# EAGLE design WSP2 (EAGLE 6.4)

## Sheet 1 of 4
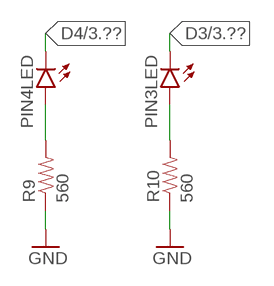
[diagram p0: schematic, sheet 1]

### Parts
PIN3LED  LED0603  [LED-0603]
PIN4LED  LED0603  [LED-0603]
R9  560  RESISTOR0603-RES  [0603-RES]
R10  560  RESISTOR0603-RES  [0603-RES]

### Nets
D3: PIN3LED.C ; also sheet 3
D4: PIN4LED.C ; also sheet 3
GND: R9.1 R10.1 ; also sheet 2,3,4
N$9: PIN4LED.A R9.2
N$10: PIN3LED.A R10.2

## Sheet 2 of 4
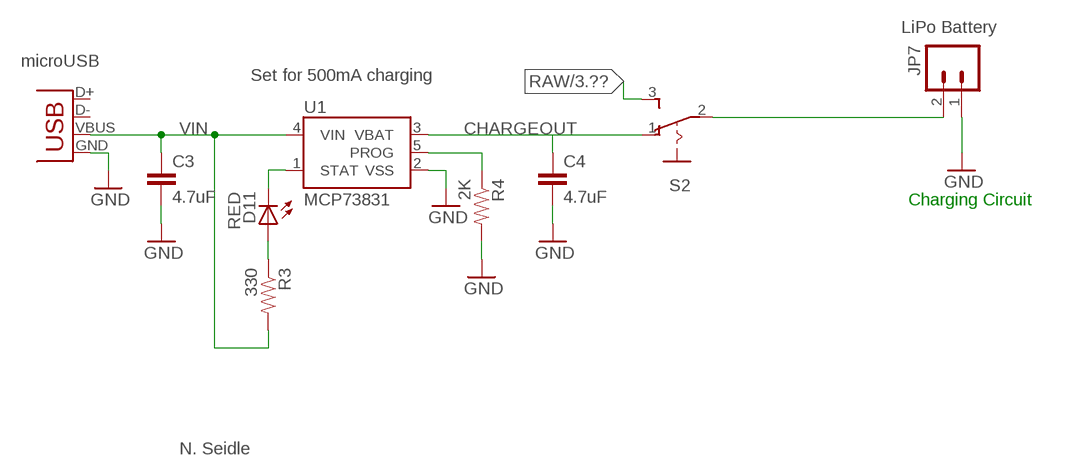
[diagram p1: schematic, sheet 2]

### Parts
C3  4.7uF  CAP0402-CAP  [0402-CAP]
C4  4.7uF  CAP0402-CAP  [0402-CAP]
D11  RED  LED0603  [LED-0603]
JP7  LiPo Battery  M02-JST-2MM-SMT  [JST-2-SMD]
R3  330  RESISTOR0402-RES  [0402-RES]
R4  2K  RESISTOR0402-RES  [0402-RES]
S2  255SB  [255SB]
U1  MCP73831  [SOT23-5]
X1  Micro USB  USB-MICROB  [USB-MICROB]

### Nets
CHARGEOUT: C4.1 S2.1(O) U1.3(VBAT)
GND: C3.2 C4.2 JP7.1 R4.2 U1.2(VSS) X1.GND ; also sheet 1,3,4
N$3: D11.A R3.1
POSBAT [vcc]: JP7.2 S2.2(P)
PROG: R4.1 U1.5(PROG)
RAW [vcc]: S2.3(S) ; also sheet 3
STAT: D11.C U1.1(STAT)
VIN: C3.1 R3.2 U1.4(VIN) X1.VBUS
Unconnected: X1.D+ X1.D-

### Notes on the sheet
- microUSB
- Set for 500mA charging
- Charging Circuit
- N. Seidle

## Sheet 3 of 4
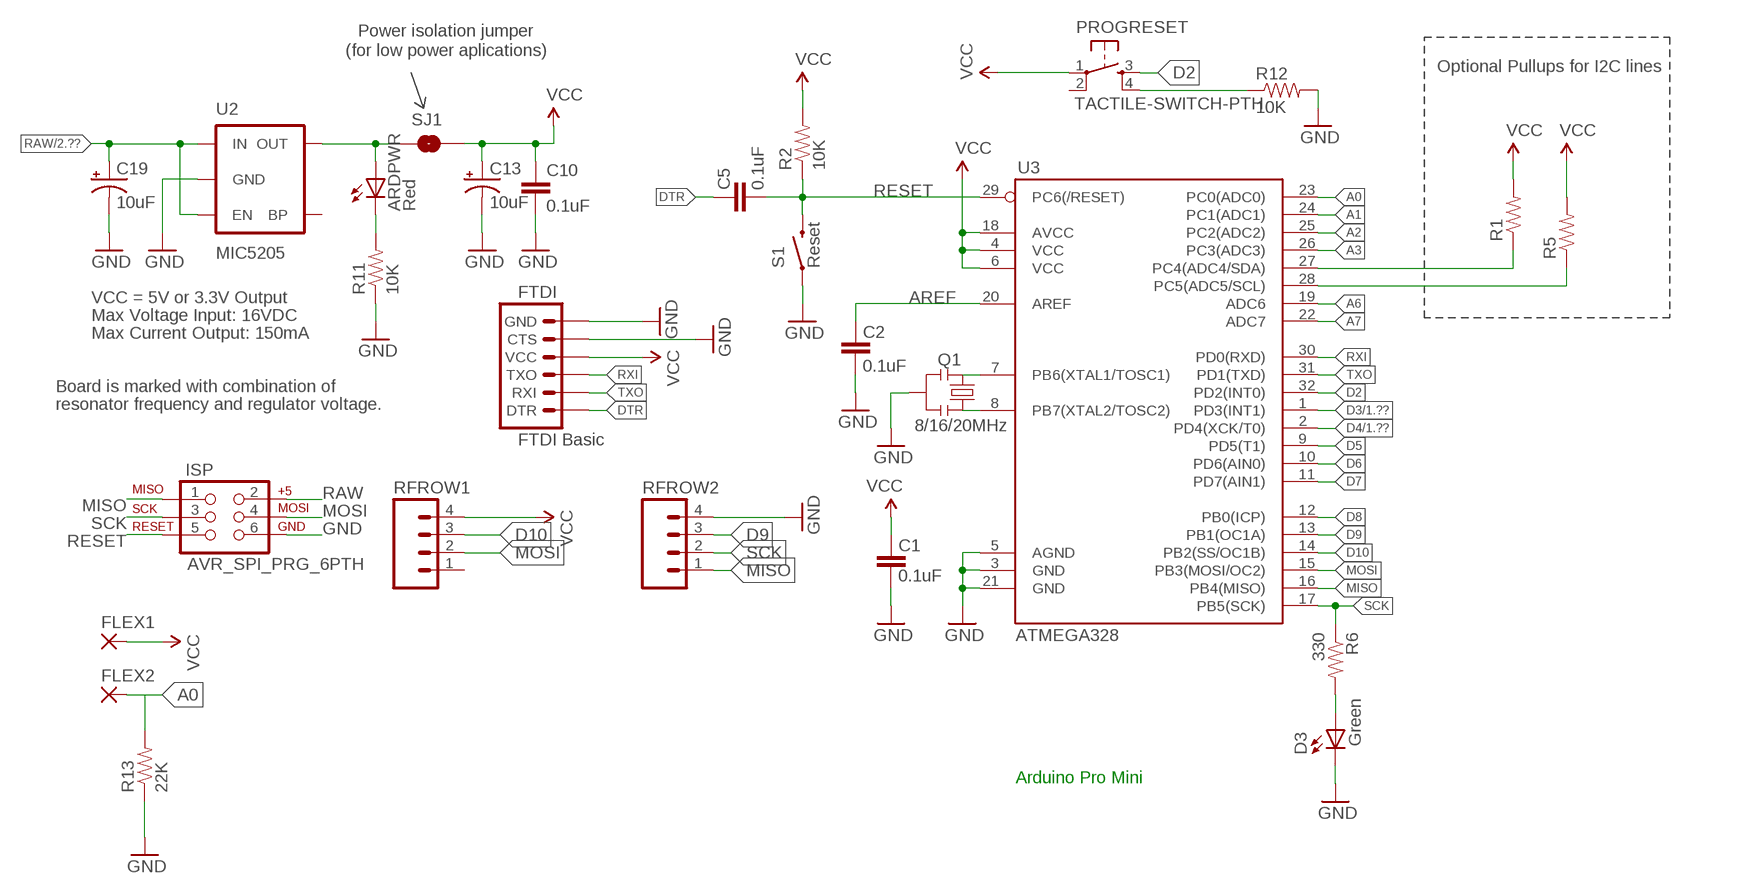
[diagram p2: schematic, sheet 3]

### Parts
ARDPWR  Red  LED  [0603-LED-ALT1]
C1  0.1uF  CAP0603-CAP  [0603-CAP]
C2  0.1uF  CAP0603-CAP  [0603-CAP]
C5  0.1uF  CAP0603-CAP  [0603-CAP]
C10  0.1uF  CAP0603-CAP  [0603-CAP]
C13  10uF  CAP_POL1206  [EIA3216]
C19  10uF  CAP_POL1206  [EIA3216]
D3  Green  LED  [0603-LED-ALT1]
FLEX1  1,6/0,9  [1,6/0,9]
FLEX2  1,6/0,9  [1,6/0,9]
FTDI  FTDI Basic  ARDUINO_SERIAL_PROGRAMPTH  [1X06]
ISP  AVR_SPI_PRG_6PTH  [2X3]
PROGRESET  TACTILE-SWITCH-PTH  [TAC-SWITCH-PTH]
Q1  8/16/20MHz  RESONATOR1:1  [RESONATOR-SMD-1:1]
R1  RESISTOR0603-RES  [0603-RES]
R2  10K  RESISTOR0603-RES  [0603-RES]
R5  RESISTOR0603-RES  [0603-RES]
R6  330  RESISTOR0603-RES  [0603-RES]
R11  10K  RESISTOR0603-RES  [0603-RES]
R12  10K  RESISTOR0603-RES  [0603-RES]
R13  22K  RESISTOR0603-RES  [0603-RES]
RFROW1  M041.27MM  [1X04-1.27MM]
RFROW2  M041.27MM  [1X04-1.27MM]
S1  Reset  SWITCH-MOMENTARY-2SMD-ALT01  [TACTILE-SWITCH-SMD-ALT01]
SJ1  SOLDERJUMPERNC  [SJ_2S]
U2  MIC5205  V_REG_LDOSMD  [SOT23-5]
U3  ATMEGA328  ATMEGA168  [TQFP32-08]

### Nets
3.3V: FLEX1.1(P) FTDI.4(VCC) PROGRESET.1 RFROW1.4 ; supply symbol labelled VCC
A0: FLEX2.1(P) R13.2 U3.23(PC0(ADC0))
A1: U3.24(PC1(ADC1))
A2: U3.25(PC2(ADC2))
A3: U3.26(PC3(ADC3))
A5: R5.1 U3.28(PC5(ADC5/SCL))
A6: U3.19(ADC6)
A7: U3.22(ADC7)
AREF: C2.2 U3.20(AREF)
D2: PROGRESET.3 U3.32(PD2(INT0))
D3: U3.1(PD3(INT1)) ; also sheet 1
D4: U3.2(PD4(XCK/T0)) ; also sheet 1
D5: U3.9(PD5(T1))
D6: U3.10(PD6(AIN0))
D7: U3.11(PD7(AIN1))
D8: U3.12(PB0(ICP))
D9: RFROW2.3 U3.13(PB1(OC1A))
D10: RFROW1.3 U3.14(PB2(SS/OC1B))
DTR: C5.2 FTDI.1(DTR)
GND: C1.1 C2.1 C10.2 C13.C(-) C19.C(-) D3.C FTDI.5(CTS) FTDI.6(GND) ISP.6 Q1.2 R11.1 R12.2 R13.1 RFROW2.4 S1.1 S1.2 U2.2(GND) U3.3(GND) U3.5(AGND) U3.21(GND) ; also sheet 1,2,4
MISO: ISP.1 RFROW2.1 U3.16(PB4(MISO))
MOSI: ISP.4 RFROW1.2 U3.15(PB3(MOSI/OC2))
N$1: Q1.3 U3.8(PB7(XTAL2/TOSC2))
N$2: Q1.1 U3.7(PB6(XTAL1/TOSC1))
N$4: ARDPWR.A SJ1.1 U2.5(OUT)
N$5: ARDPWR.C R11.2
N$7: D3.A R6.2
N$11: PROGRESET.4 R12.1
RAW [vcc]: C19.A(+) ISP.2 U2.1(IN) U2.3(EN) ; also sheet 2
RESET: C5.1 ISP.5 R2.1 S1.3 S1.4 U3.29(PC6(/RESET))
RXI: FTDI.3(TXO) U3.30(PD0(RXD))
SCK: ISP.3 R6.1 RFROW2.2 U3.17(PB5(SCK))
SDA: R1.1 U3.27(PC4(ADC4/SDA)) ; also sheet 4
TXO: FTDI.2(RXI) U3.31(PD1(TXD))
VCC: C1.2 C10.1 C13.A(+) R1.2 R2.2 R5.2 SJ1.2 U3.4(VCC) U3.6(VCC) U3.18(AVCC) ; also sheet 4
Unconnected: PROGRESET.2 RFROW1.1 U2.4(BP)

### Notes on the sheet
- Power isolation jumper
- (for low power aplications)
- Optional Pullups for I2C lines
- VCC = 5V or 3.3V Output
- Max Voltage Input: 16VDC
- Max Current Output: 150mA
- Board is marked with combination of
- resonator frequency and regulator voltage.
- Arduino Pro Mini

## Sheet 4 of 4
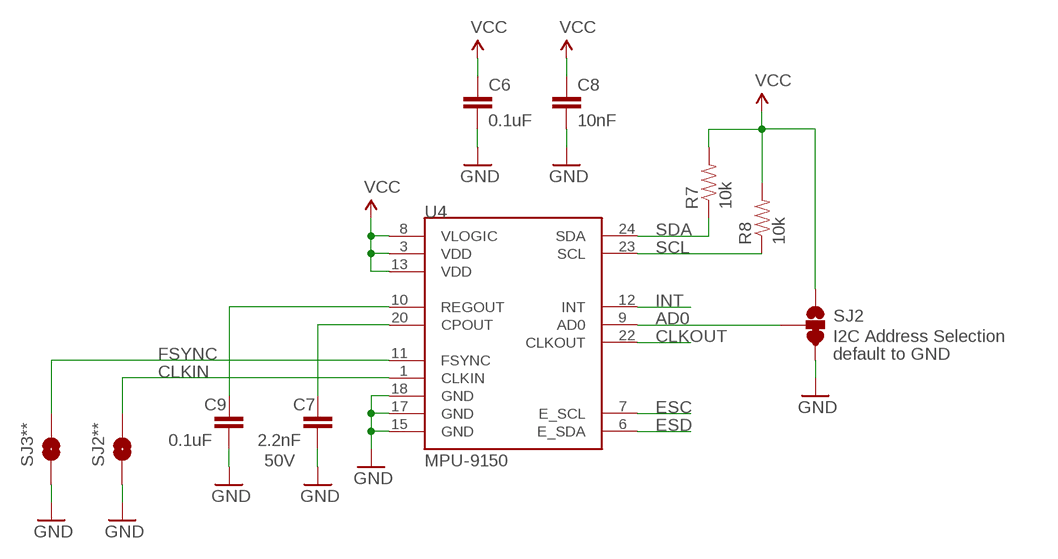
[diagram p3: schematic, sheet 4]

### Parts
C6  0.1uF  CAP0402-CAP  [0402-CAP]
C7  2.2nF  CAP0402-CAP  [0402-CAP]
C8  10nF  CAP0402-CAP  [0402-CAP]
C9  0.1uF  CAP0402-CAP  [0402-CAP]
R7  10k  RESISTOR0402-RES  [0402-RES]
R8  10k  RESISTOR0402-RES  [0402-RES]
SJ2  SOLDERJUMPER_2WAYPASTE2&3  [SJ_3_PASTE2&3]
SJ2**  SOLDERJUMPERTRACE  [SJ_2S-TRACE]
SJ3**  SOLDERJUMPERTRACE  [SJ_2S-TRACE]
U4  MPU-9150  MPU-9150QFN-24-NP  [QFN-24-NP]

### Nets
AD0: SJ2.2 U4.9(AD0)
CLKIN: SJ2**.2 U4.1(CLKIN)
CLKOUT: U4.22(CLKOUT)
ESC: U4.7(E_SCL)
ESD: U4.6(E_SDA)
FSYNC: SJ3**.2 U4.11(FSYNC)
GND: C6.2 C7.2 C8.2 C9.2 SJ2**.1 SJ2.3 SJ3**.1 U4.15(GND) U4.17(GND) U4.18(GND) ; also sheet 1,2,3
INT: U4.12(INT)
N$6: C7.1 U4.20(CPOUT)
N$8: C9.1 U4.10(REGOUT)
SCL: R8.1 U4.23(SCL)
SDA: R7.1 U4.24(SDA) ; also sheet 3
VCC: C6.1 C8.1 R7.2 R8.2 SJ2.1 U4.3(VDD) U4.8(VLOGIC) U4.13(VDD) ; also sheet 3

### Notes on the sheet
- I2C Address Selection
- default to GND
- 50V

## Library data of the parts
ARDPWR D3 = Testing:LED: LEDs Standard schematic elements and footprints for 5mm, 3mm, 1206, and 0603 sized LEDs. 5mm - Spark Fun Electronics SKU : COM-00529 (and others)
C1-C5 C10 = SparkFun:CAP: Capacitor Standard 0603 ceramic capacitor, and 0.1" leaded capacitor.
C6-C9 = SparkFun-Passives:CAP: Capacitor Standard 0603 ceramic capacitor, and 0.1" leaded capacitor.
C13 C19 = SparkFun:CAP_POL: Capacitor Polarized These are standard SMD and PTH capacitors. Normally 10uF, 47uF, and 100uF in electrolytic and tantalum varieties. Always verify the external diameter of the through hole cap, it varies with capacity, voltage, and manufacturer. The EIA devices should be standard.
D11 = SparkFun:LED: LEDs Standard schematic elements and footprints for 5mm, 3mm, 1206, and 0603 sized LEDs. 5mm - Spark Fun Electronics SKU : COM-00529 (and others)
FLEX1 FLEX2 = wirepad:1,6/0,9: THROUGH-HOLE PAD
FTDI = SparkFun:ARDUINO_SERIAL_PROGRAM
ISP = SparkFun-Connectors:AVR_SPI_PRG_6: AVR ISP 6 Pin This is the reduced ISP connector for AVR programming. Common on Arduino. This footprint will take up less PCB space and can be used with a 10-pin to 6-pin adapter such as SKU: BOB-08508 **Special note about "TEST_POINT" package. The stop mask is on the top side, so if you want your programming test points to be on the bottom of your board, make sure to place this package on the bottom side of the board. This also ensure that the orientation to program from the bottom side will be correct.
JP7 = SparkFun:M02: Header 2 Standard 2-pin 0.1" header. Use with straight break away headers (SKU : PRT-00116), right angle break away headers (PRT-00553), swiss pins (PRT-00743), machine pins (PRT-00117), and female headers (PRT-00115). Molex polarized connector foot print use with SKU : PRT-08233 with associated crimp pins and housings.
PIN3LED PIN4LED = SparkFun-LED:LED: LEDs Standard schematic elements and footprints for 5mm, 3mm, 1206, and 0603 sized LEDs. 5mm - Spark Fun Electronics SKU : COM-00529 (and others)
PROGRESET = GeekAmmo:TACTILE-SWITCH: Tactile Switch 4 Pins, SPST NO
Q1 = Testing:RESONATOR: Resonator Small SMD resonator. This is the itty bitty 10/20MHz resonators with built in caps. CSTCE10M0G55 and CSTCE20M0V53. Footprint for SMD has been used in SFE production for years, and does work okay. 1:1 is an attempt to get larger fillets on the sides so it will be easier to inspect these solders in our AOI machine. The pads have been minimized to match the actual metal under the resonator. To see this relation, it includes an image import of the bottom side of the component. Imported to scale on layer 200.
R1-R6 R11 = SparkFun:RESISTOR: Resistor Basic schematic elements and footprints for 0603, 1206, and PTH resistors.
R7 R8 = SparkFun-Passives:RESISTOR: Resistor Basic schematic elements and footprints for 0603, 1206, and PTH resistors.
R9 R10 R12 R13 = SparkFun-Resistors:RESISTOR: Resistor Basic schematic elements and footprints for 0603, 1206, and PTH resistors.
RFROW1 RFROW2 = SparkFun-Connectors:M04: Header 4 Standard 4-pin 0.1" header. Use with straight break away headers (SKU : PRT-00116), right angle break away headers (PRT-00553), swiss pins (PRT-00743), machine pins (PRT-00117), and female headers (PRT-00115). Molex polarized connector foot print use with SKU : PRT-08231 with associated crimp pins and housings. 1MM SMD Version SKU: PRT-10208
S1 = Testing:SWITCH-MOMENTARY-2: Various NO switches- pushbuttons, reed, etc
S2 = switch:255SB: SLIDING SWITCH Distributor Buerklin, 11G810
SJ1 SJ2** SJ3** = SparkFun-Passives:SOLDERJUMPER: Solder Jumper Standard SMD solder jumper. Used to automate production. Two varients : Normally Open and Normally Closed are the same, but have different paste layers. NC will have a large amount of paste and should jumper during reflow.
SJ2 = SparkFun-Passives:SOLDERJUMPER_2WAY: Solder Jumper 2 way solder jumper
U1 = SparkFun:MCP73831: Microchip's MCP73831 Miniature single cell, fully integrated Li-Ion, Li-polymer charge management controller http://ww1.microchip.com/downloads/en/DeviceDoc/21984a.pdf
U2 = SparkFun:V_REG_LDO: Voltage Regulator LDO Standard 150mA LDO voltage regulator in SOT-23 layout. Micrel part MIC5205. BP (by-pass) pin is used to lower output noise with 470pF cap.
U3 = SparkFun:ATMEGA168
U4 = SparkFun-Sensors:MPU-9150: 9DOF (3mag, 3accel, 3rotat). I2C interface.
X1 = SparkFun:USB: USB Connectors USB-B-PTH is fully proven SKU : PRT-00139 USB-miniB is fully proven SKU : PRT-00587 USB-A-PCB is untested. USB-A-H is throughly reviewed, but untested. Spark Fun Electronics SKU : PRT-00437 USB-B-SMT is throughly reviewed, but untested. Needs silkscreen touching up. USB-A-S has not been used/tested USB-MB-H has not been used/tested

## Net classes
1 vcc: width 0.254 mm

## Board
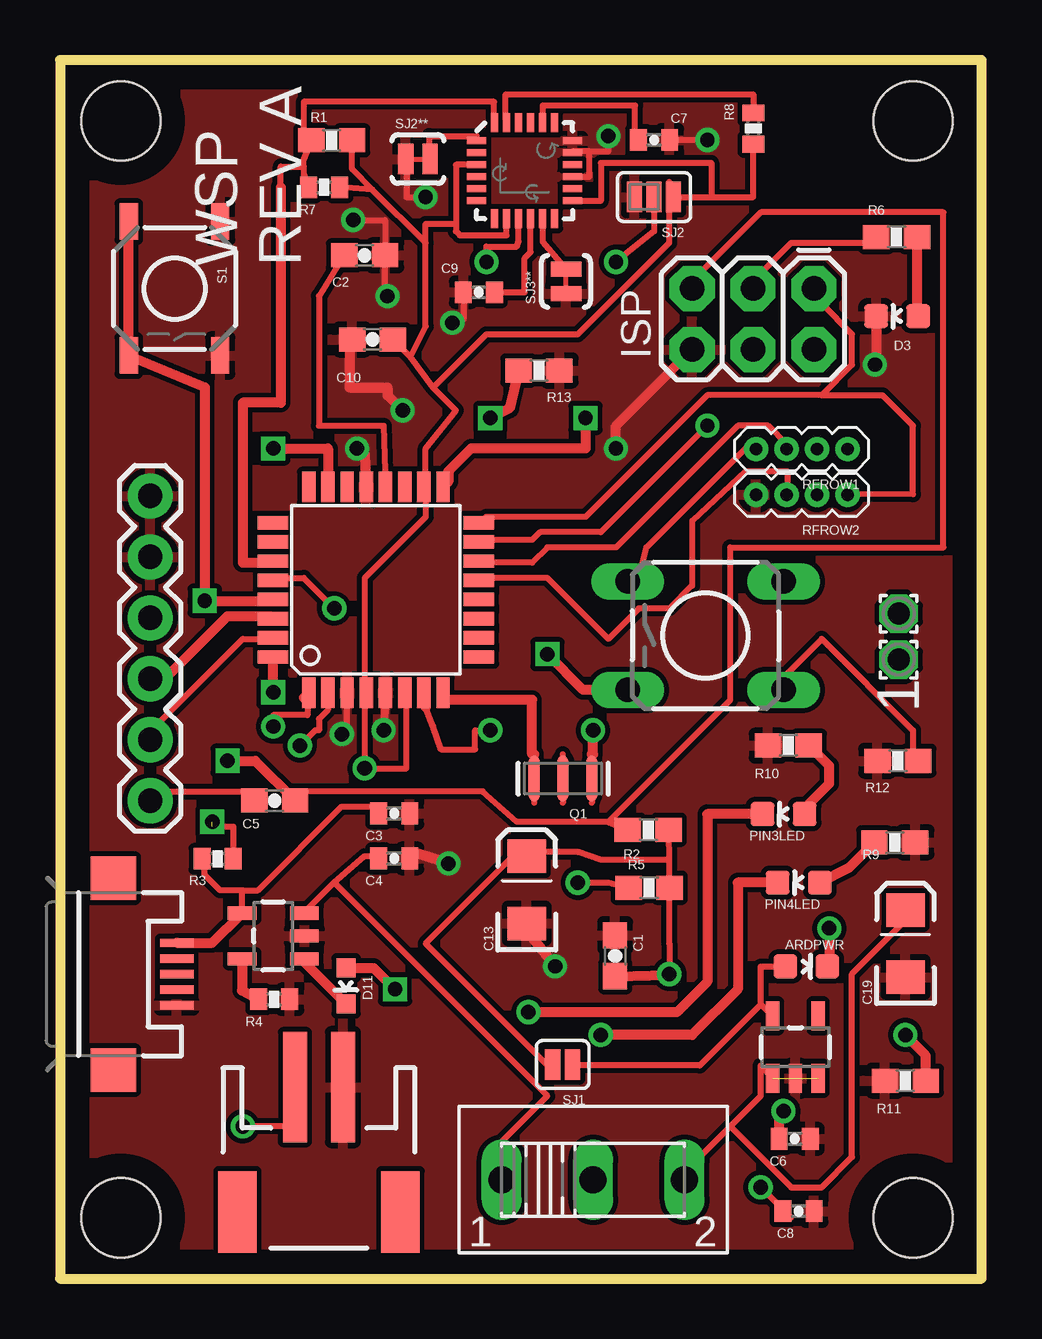
[diagram p4: board, top side]
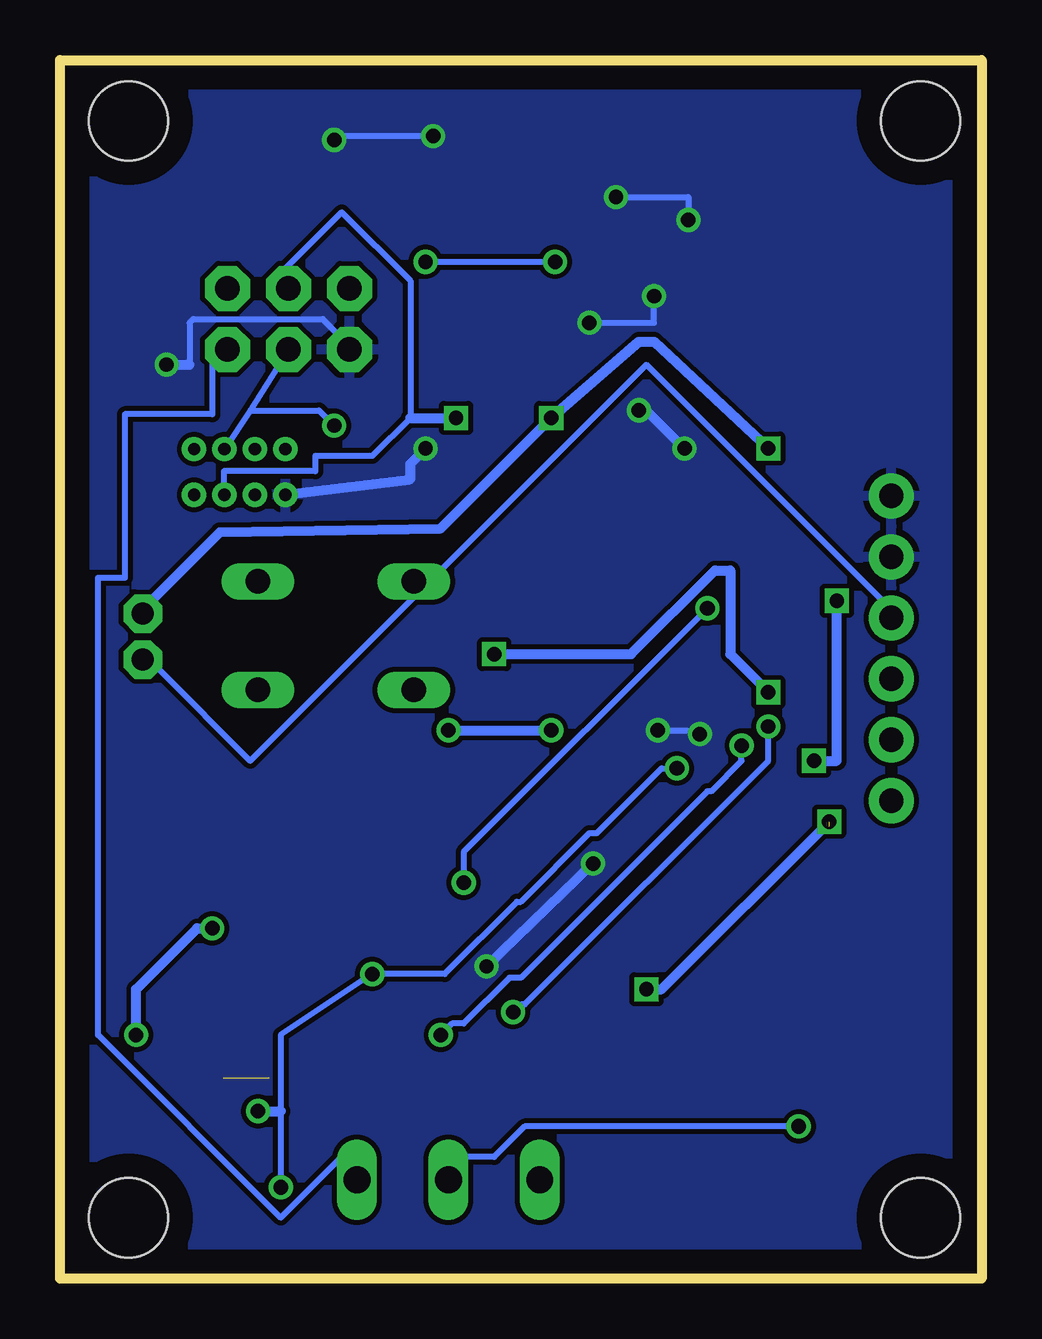
[diagram p5: board, bottom side, seen from below]

Size 38.42 x 50.8 mm. Coordinates in mm from the lower left corner, seen from the top.
Outline: 0,0 38.42,0 38.42,50.8 0,50.8 0,0
Copper layers (1*16): Top 0.035mm / dielectric 1.5mm / Bottom 0.035mm
Design rules "default": minimum track width 10mil, minimum drill 24mil, track to track 8mil, track to pad 8mil, pad to pad 8mil, via to via 8mil, smd to smd 8mil, copper to edge 40mil, drill to drill 8mil, minimum pad ring 10mil, minimum via ring 8mil, stop-mask expansion 4mil, vias tented up to drill 0mil, thermal gap 10mil

### Footprints (pad centres in the part's own frame; a part is rotated, then mirrored left to right if it is on the bottom)
0603-LED-ALT1 = smd 1 x 1: A 0,-0.877; C 0,0.877
0603-CAP = smd 1.1 x 1: 1 -0.85,0; 2 0.85,0
0402-CAP = smd 0.7 x 0.9: 1 -0.65,0; 2 0.65,0
EIA3216 = smd 1.4 x 1.6: A 1.4,0; C -1.4,0
LED-0603 = smd 0.8 x 0.8: A 0,-0.75; C 0,0.75
1,6/0,9 = drill 0.914 pad 1.6 octagon: 1 0,0
1X06 = drill 1.016 pad 1.88: 1 0,0; 2 2.54,0; 3 5.08,0; 4 7.62,0; 5 10.16,0; 6 12.7,0
2X3 = drill 1.016 pad 1.88 octagon: 1 0,0; 2 0,2.54; 3 2.54,0; 4 2.54,2.54; 5 5.08,0; 6 5.08,2.54
STAND-OFF = hole 3.302: 0,0
JST-2-SMD = smd 1 x 4.6: 1 -1,-3.7; 2 1,-3.7 | smd 1.6 x 3.4: NC1 -3.4,1.5; NC2 3.4,1.5
LED-0603' = smd 1 x 1: A 0,-0.877; C 0,0.877
TAC-SWITCH-PTH = drill 1.016 pad 1.524 long: 1 -3.251,2.261; 2 3.251,2.261; 3 -3.251,-2.261; 4 3.251,-2.261
RESONATOR-SMD-1:1 = smd 0.45 x 1.905: 1 -1.2,0; 2 0,0; 3 1.2,0
0603-RES = smd 1.1 x 1: 1 -0.85,0; 2 0.85,0
0402-RES = smd 0.7 x 0.9: 1 -0.65,0; 2 0.65,0
1X04-1.27MM = drill 0.508 pad 1: 1 0,0; 2 1.27,0; 3 2.54,0; 4 3.81,0
TACTILE-SWITCH-SMD-ALT01 = smd 1.524 x 0.762: 1 -2.794,1.905; 2 2.794,1.905; 3 -2.794,-1.905; 4 2.794,-1.905
255SB = drill 1.118 long: 1 -3.81,0; 2 0,0; 3 3.81,0
SJ_2S = smd 0.635 x 1.27: 1 -0.412,0; 2 0.412,0
SJ_3_PASTE2&3 = smd 0.635 x 1.27: 1 -0.813,0; 2 0,0; 3 0.813,0
SJ_2S-TRACE = smd 0.635 x 1.27: 1 -0.508,0; 2 0.508,0
SOT23-5 = smd 0.55 x 1.2: 1 -0.95,-1.3; 2 0,-1.3; 3 0.95,-1.3; 4 0.95,1.3; 5 -0.95,1.3
TQFP32-08 = smd 1.27 x 0.559: 1 -4.293,2.8; 2 -4.293,2; 3 -4.293,1.2; 4 -4.293,0.4; 5 -4.293,-0.4; 6 -4.293,-1.2; 7 -4.293,-2; 8 -4.293,-2.8; 17 4.293,-2.8; 18 4.293,-2; 19 4.293,-1.2; 20 4.293,-0.4; 21 4.293,0.4; 22 4.293,1.2; 23 4.293,2; 24 4.293,2.8 | smd 0.559 x 1.27: 9 -2.8,-4.293; 10 -2,-4.293; 11 -1.2,-4.293; 12 -0.4,-4.293; 13 0.4,-4.293; 14 1.2,-4.293; 15 2,-4.293; 16 2.8,-4.293; 25 2.8,4.293; 26 2,4.293; 27 1.2,4.293; 28 0.4,4.293; 29 -0.4,4.293; 30 -1.2,4.293; 31 -2,4.293; 32 -2.8,4.293
QFN-24-NP = smd 0.8 x 0.3: 1 -2,1.25; 2 -2,0.75; 3 -2,0.25; 4 -2,-0.25; 5 -2,-0.75; 6 -2,-1.25; 13 2,-1.25; 14 2,-0.75; 15 2,-0.25; 16 2,0.25; 17 2,0.75; 18 2,1.25 | smd 0.3 x 0.8: 7 -1.25,-2; 8 -0.75,-2; 9 -0.25,-2; 10 0.25,-2; 11 0.75,-2; 12 1.25,-2; 19 1.25,2; 20 0.75,2; 21 0.25,2; 22 -0.25,2; 23 -0.75,2; 24 -1.25,2
USB-MICROB = smd 0.35 x 1.4: D+ 0,2.65; D- -0.65,2.65; GND 1.3,2.65; ID 0.65,2.65; VBUS -1.3,2.65 | smd 1.8 x 1.9: MT1 -4,0; MT2 4,0

### Placement (x,y rotation side)
ARDPWR  31.11,13.02 270 top
C1  23.14,13.46 270 top
C2  12.7,42.66 180 top
C3  13.93,19.39 0 top
C4  13.93,17.52 0 top
C5  8.95,19.93 180 top
C6  30.63,5.83 0 top
C7  24.77,47.47 0 top
C8  30.78,2.82 0 top
C9  17.46,41.12 180 top
C10  13.03,39.15 180 top
C13  19.46,16.21 90 top
C19  35.24,13.97 90 top
D3  34.9,40.12 90 top
D11  11.93,12.2 180 top
FLEX1  34.96,25.81 0 top
FLEX2  34.96,27.72 0 top
FTDI  3.76,19.93 90 top
ISP  31.43,41.27 180 top
JP1  STAND-OFF  [STAND-OFF]  2.54,2.54 0 top
JP2  STAND-OFF  [STAND-OFF]  35.56,48.26 0 top
JP7  10.79,4.29 180 top
JP14  STAND-OFF  [STAND-OFF]  2.54,48.26 0 top
JP15  STAND-OFF  [STAND-OFF]  35.56,2.54 0 top
PIN3LED  [LED-0603']  30.16,19.37 90 top
PIN4LED  [LED-0603']  30.8,16.51 90 top
PROGRESET  26.91,26.81 0 top
Q1  20.97,20.85 180 top
R1  11.33,47.45 0 top
R2  24.52,18.71 0 top
R3  6.57,17.5 180 top
R4  8.93,11.65 0 top
R5  24.56,16.29 0 top
R6  34.87,43.42 0 top
R7  11.01,45.49 0 top
R8  28.91,47.94 270 top
R9  34.8,18.19 180 top
R10  30.37,22.23 0 top
R11  35.24,8.26 0 top
R12  34.92,21.59 180 top
R13  19.97,37.86 180 top
RFROW1  32.83,34.58 180 top
RFROW2  32.83,32.68 180 top
S1  4.78,41.27 270 top
S2  22.23,4.13 0 top
SJ1  20.95,8.93 180 top
SJ2  24.77,45.09 180 top
SJ2**  14.92,46.67 0 top
SJ3**  21.09,41.57 90 top
U1  8.89,14.29 90 top
U2  30.66,9.65 0 top
U3  13.17,28.71 90 top
U4  19.37,46.18 0 top
X1  2.22,12.7 270 top

### Tracks (layer width: path | path; a pad name or v marks a point on that pad's centre or on a via)
3.3V
  Top 0.254: RFROW1.4 28.57,34.61 24.45,30.48 24.13,29.21 PROGRESET.1
  Bottom 0.254: 22.86,29.21 30.48,21.59 34.29,25.4 FLEX1.1 | 22.86,29.21 13.97,38.1 3.81,27.94 FTDI.4 | 22.86,29.21 PROGRESET.1
A0  (via drill 0.6)
  Top 0.406: R13.2 18.73,36.27 v17.94,35.88 | v8.89,34.61 11.17,34.61 U3.23
  Bottom 0.406: v8.89,34.61 13.65,39.05 14.29,39.05 v17.94,35.88 22.54,31.27 31.75,31.11 34.96,27.9 FLEX2.1
A5  (via drill 0.61)
  Top 0.254: v21.59,16.51 22.86,16.51 R5.1 | v11.43,27.94 10.16,29.21 8.89,29.21 U3.28
  Bottom 0.254: v21.59,16.51 21.59,17.78 v11.43,27.94
AD0  (via drill 0.6)
  Top 0.254: SJ2.2 24.77,43.66 v23.18,42.39 | v17.78,42.39 17.78,43.02 19.05,43.02 19.12,43.25 U4.9
  Bottom 0.254: v23.18,42.39 v17.78,42.39
AREF
  Top 0.254: C2.2 10.79,40.96 10.79,35.56 13.49,35.56 U3.20
CHARGEOUT
  Top 0.254: 11.43,16.51 10.16,15.24 U1.3 | 11.43,16.51 12.7,17.62 13.18,17.62 C4.1 | 11.43,16.51 20.32,7.62 17.78,5.08 S2.1
CLKIN
  Top 0.254: SJ2**.2 15.4,46.67 15.4,47.62 17.37,47.62 U4.1
D2  (via drill 0.6)
  Top 0.406: PROGRESET.3 21.81,24.55 v20.32,26.04 | v8.89,24.45 U3.32
  Bottom 0.406: v20.32,26.04 14.61,26.04 11.11,29.53 10.48,29.53 10.48,26.04 v8.89,24.45
D3  (via drill 0.6)
  Top 0.254: U3.1 10.32,24.42 10.32,23.5 8.89,23.5 v8.89,23.02
  Top 0.406: PIN3LED.C 26.99,19.37 26.99,12.38 25.72,11.11 v19.53,11.11 | 10.16,24.21 U3.1
  Bottom 0.254: v8.89,23.02 8.89,21.59 19.05,11.43 19.21,11.43 v19.53,11.11
  Bottom 0.406: v19.53,11.11 19.37,11.11
D4  (via drill 0.6)
  Top 0.254: U3.2 11.17,23.71 10.79,23.34 10.79,22.86 10.64,22.86 v10,22.23
  Top 0.406: PIN4LED.C 28.26,16.51 28.26,12.06 26.35,10.16 v22.54,10.16 | 11.11,24.36 U3.2
  Bottom 0.254: v10,22.23 10,21.59 11.27,20.32 11.43,20.32 19.21,12.54 19.68,12.54 21.59,10.64 22.07,10.64 v22.54,10.16
  Bottom 0.406: v22.54,10.16 22.23,10.16
D9
  Top 0.254: U3.13 17.78,29.21 20.32,29.21 22.86,26.67 24.13,27.94 25.4,27.94 26.35,28.89 26.35,31.59 28.57,33.66 30.32,33.66 30.32,32.87 RFROW2.3
D10
  Top 0.254: RFROW1.3 30.29,34.8 29.53,35.56 28.26,35.56 23.18,30.48 20.32,30.48 19.68,29.84 17.53,29.84 U3.14
DTR
  Top 0.254: C5.2 7.62,20.32 3.81,20.32 FTDI.1
FSYNC
  Top 0.254: 20.64,42.06 SJ3**.2 20.12,43.22 U4.11
GND  (via drill 0.6)
  Top 0.254: SJ2**.1 14.45,46.67 14.45,45.09 v15.24,45.09 | v12.22,44.13 13.55,44.13 C2.1 13.55,40.96 v13.65,40.96 | C9.2 16.83,41.12 16.83,40.01 16.35,40.01 v16.35,39.85 | 22.07,46.99 21.37,46.99 U4.17 | v11.75,22.7 11.97,22.54 U3.3 | U4.15 22.07,45.93 22.07,46.99 | 22.07,46.99 22.86,46.99 v22.86,47.62 | v26.99,47.47 C7.2 | U3.5 13.49,24.42 v13.49,22.86 13.65,24.42 U3.5
  Top 0.406: C10.2 12.06,39.15 12.06,37.15 13.65,37.15 13.65,36.83 v14.29,36.2 | v12.38,34.61 12.7,34.35 U3.21 | D3.C 34.02,38.15 v33.97,38.1 | v23.18,34.61 23.18,35.56 ISP.6 | C13.C 19.46,14.52 v20.64,13.02 | v16.19,17.3 14.68,17.78 C4.2
  Bottom 0.254: v15.24,45.09 12.22,45.09 v12.22,44.13 | v16.35,39.85 13.65,39.85 v13.65,40.96 | v13.49,22.86 11.75,22.86 v11.75,22.7 | 33.02,38.1 33.02,39.85 32.86,40.01 27.46,40.01 26.35,38.89 ISP.6 | v22.86,47.62 26.99,47.62 v26.99,47.47
  Bottom 0.406: v14.29,36.2 13.97,36.2 v12.38,34.61 | v33.97,38.1 33.02,38.1 | RFROW2.4 23.84,33.31 23.81,33.34 23.81,33.97 v23.18,34.61 | v20.64,13.02 v16.19,17.3
  pour Top: -1.91,52.7 40.01,52.7 40.01,-1.91 -1.91,-1.91
  pour Bottom: -4.11,-3.96 40.54,-3.51 40.54,53.8 -4.11,53.34
MISO
  Top 0.254: 31.75,36.83 26.99,36.83 21.91,31.75 17.78,31.75 U3.16 | RFROW2.1 35.56,32.7 35.56,35.56 34.29,36.83 31.75,36.83 | 31.75,36.83 33.02,38.1 33.02,39.37 31.75,40.64 ISP.1
MOSI  (via drill 0.6)
  Top 0.254: v26.99,35.56 22.54,31.11 20,31.11 19.68,30.8 17.55,30.8 U3.15
  Bottom 0.254: ISP.4 30.48,36.2 | 30.48,36.2 RFROW1.2 | 30.48,36.2 27.62,36.2 v26.99,35.56
N$1
  Top 0.406: 19.77,21.87 19.68,21.87 19.68,24.13 15.97,24.13 U3.8
N$2  (via drill 0.6)
  Top 0.254: 15.24,23.81 15.56,23.02 15.88,22.07 17.3,22.07 17.3,22.86 v17.94,22.86
  Top 0.406: 22.17,21.87 22.23,21.87 v22.23,22.86 | 15.24,23.81 15.24,24.35 U3.7
  Bottom 0.406: v22.23,22.86 v17.94,22.86
N$3  (via drill 0.6)  (1 unrouted)
  Top 0.254: 7.14,17.5 R3.1 7.22,18.85 6.35,18.85
  Top 0.406: D11.A 13.08,12.96 v13.97,12.06
  Bottom 0.406: v13.97,12.06 13.34,12.06 v6.35,19.05
N$4
  Top 0.254: 29.21,11.43 29.21,13.02 ARDPWR.A | 29.21,11.43 26.67,8.89 21.59,8.89 SJ1.1 | 29.21,11.43 U2.5
N$5  (via drill 0.6)
  Top 0.406: R11.2 36.09,9.31 v35.24,10.16 | v32.07,14.61 32.07,13.09 ARDPWR.C
  Bottom 0.406: v35.24,10.16 35.24,12.06 32.7,14.61 v32.07,14.61
N$6
  Top 0.254: C7.1 23.97,47.47 23.97,48.9 20.12,48.9 U4.20
N$7
  Top 0.406: R6.2 35.72,40.17 D3.A
N$8
  Top 0.254: C9.1 19.37,41.12 19.37,42.55 19.62,42.8 U4.10
N$9
  Top 0.406: PIN4LED.A 32.91,17.14 R9.2
N$10
  Top 0.406: PIN3LED.A 31.11,19.68 32.07,20.64 32.07,21.37 R10.2
N$11
  Top 0.254: R12.1 35.56,21.59 35.56,22.86 31.75,26.67 29.21,24.13 PROGRESET.4
POSBAT  (via drill 0.61)
  Top 0.254: v7.62,6.35 10.16,6.35 JP7.2
  Bottom 0.254: v7.62,6.35 19.05,6.35 20.32,5.08 21.59,5.08 S2.2
PROG
  Top 0.406: U1.5 7.59,12.02 R4.1
RAW  (1 unrouted)
  Top 0.254: 27.94,6.35 26.67,5.08 S2.3 | 27.94,6.35 29.21,7.62 29.21,8.89 U2.1 | 27.94,6.35 30.48,3.81 31.75,3.81 33.02,5.08 33.02,12.7 35.56,15.24 C19.A
  Bottom 0.254: ISP.2 32.07,38.1 32.07,36.04 35.72,36.04 35.72,29.21 36.83,29.21 36.83,10.16 29.21,2.54 26.67,5.08 S2.3
RESET  (via drill 0.6)
  Top 0.254: 22.86,19.05 19.05,19.05 17.62,20.32 10.16,20.32 C5.1 | 22.86,19.05 R2.1 | 22.86,19.05 27.94,24.13 27.94,30.48 36.83,30.48 36.83,44.45 29.21,44.45 26.67,41.91 ISP.5
  Top 0.406: U3.29 8.88,28.26 v6.03,28.26 6.03,37.16 S1.4 S1.3 | v6.99,21.59 8.14,21.59 C5.1
  Bottom 0.406: v6.99,21.59 6.03,21.59 v6.03,28.26
RXI
  Top 0.406: FTDI.3 4.37,25.01 6.99,27.62 8.77,27.62 U3.30
SCK  (via drill 0.6)
  Top 0.254: R6.1 34.29,43.18 30.48,43.18 29.21,41.91 ISP.3
  Top 0.406: v21.91,35.88 21.91,34.61 17.14,34.61 16.19,33.66 16.19,33.23 U3.17
  Bottom 0.254: ISP.3 29.21,41.91 26.67,44.45 23.81,41.59 23.81,35.88 25.4,34.29 27.78,34.29 27.78,33.66 31.59,33.66 31.59,32.71 RFROW2.2
  Bottom 0.406: 23.81,35.88 v21.91,35.88
SCL
  Top 0.254: U4.23 18.57,48.34 18.57,49.37 28.91,49.37 R8.1
SDA
  Top 0.254: 9.21,45.49 9.21,46.35 10.16,46.35 | 10.16,46.35 10.16,46.67 R1.1 10.48,47.78 10.16,47.78 10.16,49.05 18.1,49.05 18.1,48.34 U4.24 | 10.16,46.35 10.16,46.04 R7.1
  Top 0.406: 9.21,45.49 9.21,36.51 7.62,36.51 7.62,29.84 8.88,29.84 U3.27
STAT
  Top 0.406: U1.1 10.19,13.19 D11.C
TXO
  Top 0.254: U3.31 8.89,26.67 7.62,26.67 3.81,22.86 FTDI.2
VCC  (via drill 0.6, 0.61)
  Top 0.254: 19.05,17.78 15.24,13.97 20.32,8.89 SJ1.2 | v29.21,3.81 30.48,2.54 C8.1 | 25.4,13.97 v25.4,12.7 | 25.4,13.97 25.4,17.46 | 25.4,17.46 25.4,17.78 R2.2 | 25.4,13.97 R5.2 | 19.05,17.78 21.59,17.78 22.54,17.46 25.4,17.46 | 19.05,17.78 C13.A | 15.56,37.15 16.51,36.2 15.24,34.61 15.24,33.02 | 15.56,37.15 14.61,38.42 | 12.7,24.13 12.7,29.21 15.24,31.75 15.24,33.02 | 15.24,33.02 U3.18 | 15.56,37.15 17.78,39.37 21.59,39.37 25.4,43.18 25.4,45.72 SJ2.1 27.15,45.09 | 15.24,43.18 13.02,45.4 | 15.24,43.18 15.24,39.69 14.61,38.42 | 13.02,45.4 R7.2 | 14.61,38.42 C10.1 | 12.7,24.13 v12.7,21.27 14.45,21.27 14.45,24.35 U3.6 | 12.7,24.13 U3.4 | 13.02,45.4 12.18,46.24 R1.2 | U4.8 18.62,43.5 16.67,43.5 16.51,43.66 16.51,43.97 | 15.24,43.18 15.24,43.97 16.51,43.97 | 27.15,45.09 28.91,45.09 R8.2 | 22.54,44.93 | U4.13 22.54,44.93 | 27.15,45.09 27.15,46.51 22.54,46.51 22.54,44.93 | U4.3 16.51,46.43 16.51,43.97
  Top 0.406: C1.2 25.36,12.66 v25.4,12.7 | U3.6 14.29,24.42 | C6.1 29.98,6.8 v30.16,6.99
  Bottom 0.254: v29.21,3.81 29.21,6.99 29.21,10.16 v25.4,12.7 22.38,12.7 19.37,15.72 19.21,15.72 16.35,18.57 16.03,18.57 13.34,21.27 v12.7,21.27
  Bottom 0.406: v30.16,6.99 29.21,6.99
VIN
  Top 0.254: U1.4 7.59,16.16 7.62,16.19 | 7.62,16.19 8.26,16.19 11.75,19.68 13.1,19.68 C3.1 | 7.62,16.19 6.67,16.19 6.03,16.83 6.03,17.39 R3.2
  Top 0.406: X1.VBUS 6.35,14 U1.4

### Text on the board
_tsilk: WSP / REV A | 1